# EAGLE board PT_2015_PB_MAIN_Rev2_Panelization (EAGLE 6.5.0)
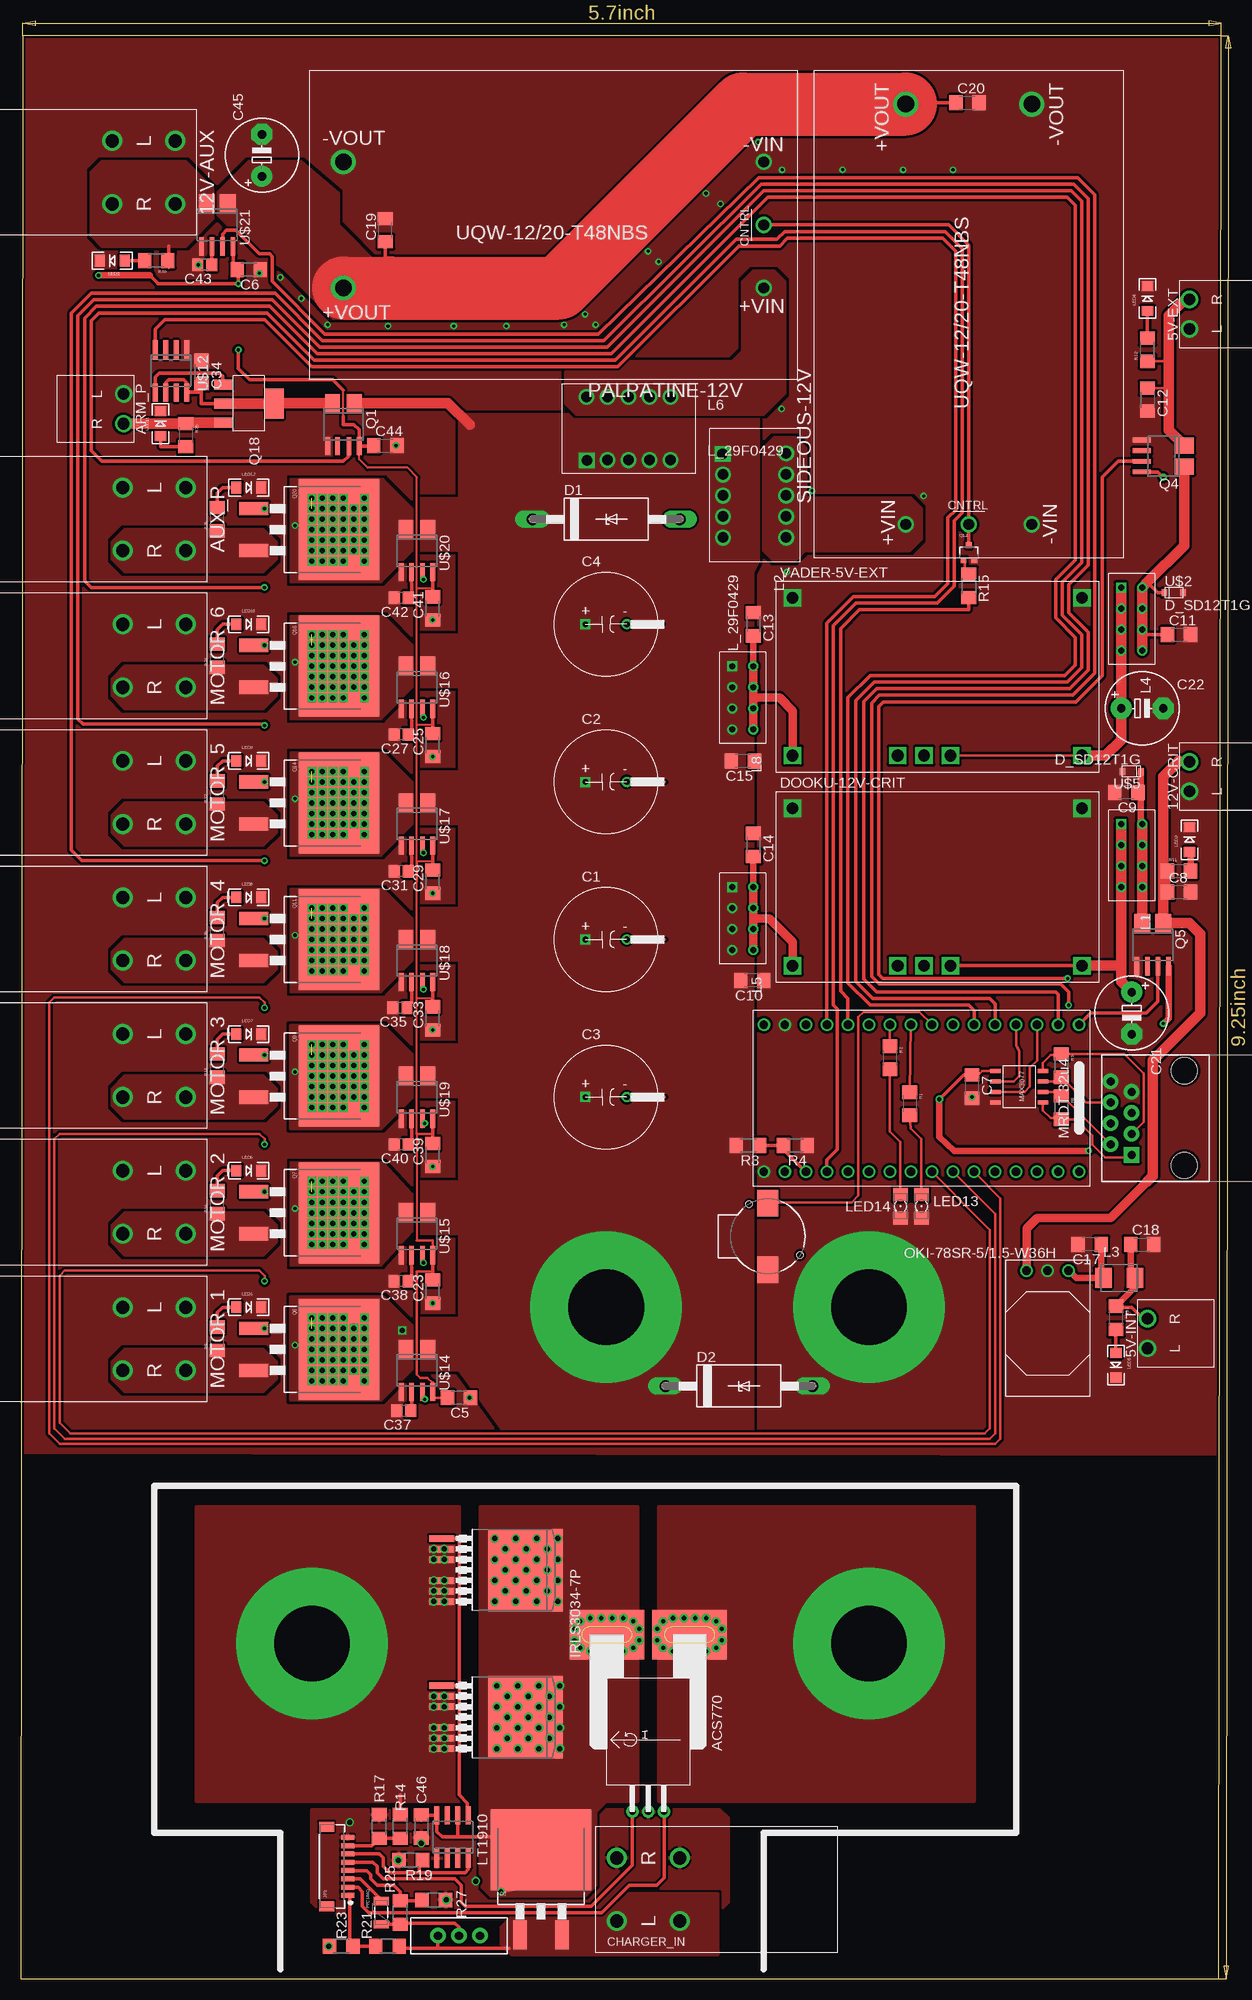
[diagram p4: board, top side]
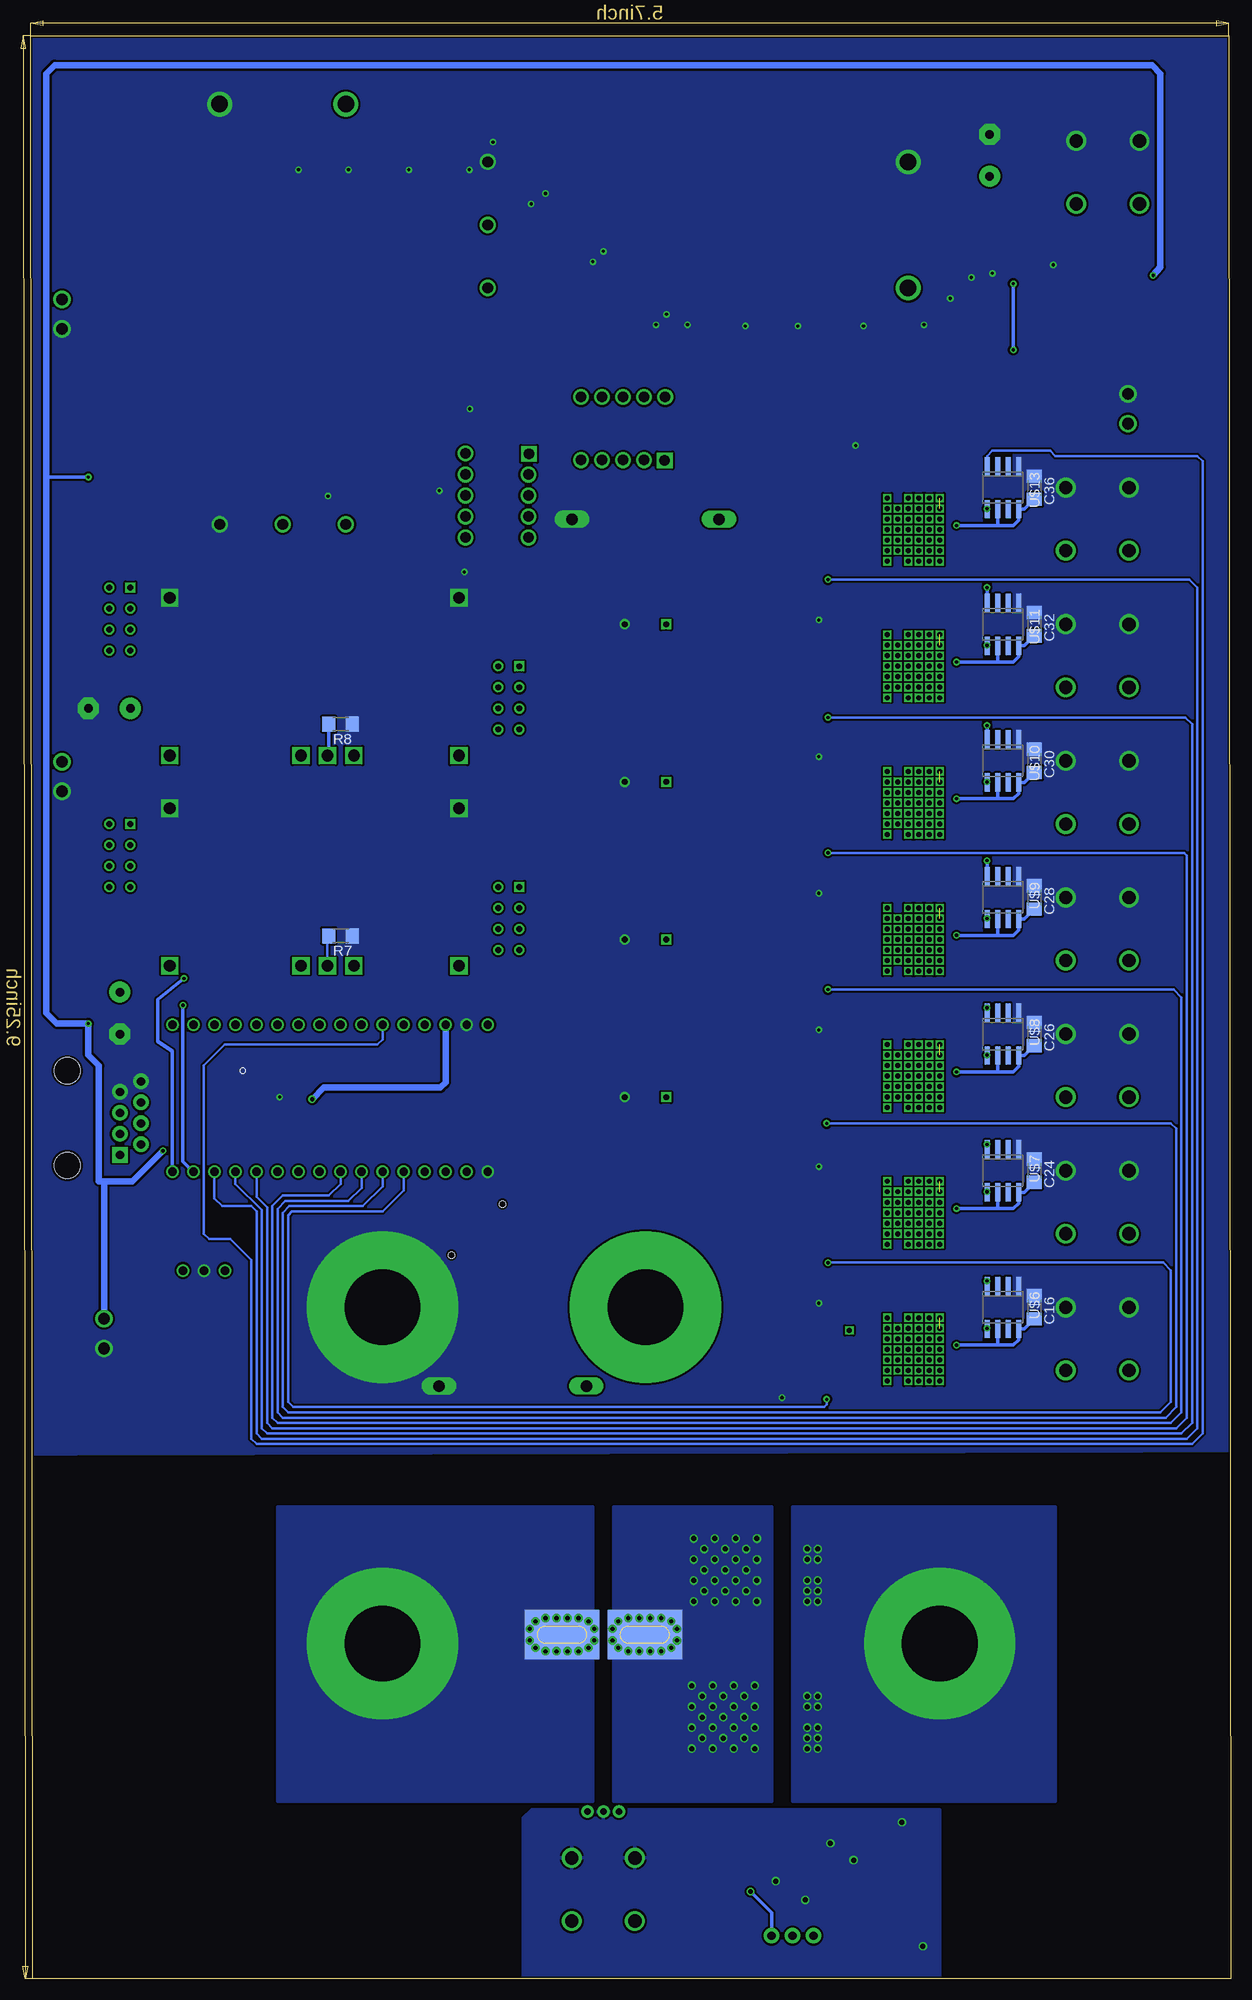
[diagram p5: board, bottom side, seen from below]

Size 145.03 x 234.82 mm. Coordinates in mm from the lower left corner, seen from the top.
Outline: 0,0 144.78,0 145.03,234.82 0.25,234.82 0,0
Copper layers (1*16): Top 0.035559375mm / dielectric 1.501140625mm / Bottom 0.035559375mm
Design rules "typical_4pcb *": minimum track width 5mil, minimum drill 15mil, track to track 10mil, track to pad 10mil, pad to pad 10mil, via to via 10mil, smd to smd 0mil, copper to edge 10mil, drill to drill 10mil, minimum pad ring 10mil, minimum via ring 8mil, stop-mask expansion 4mil, vias tented up to drill 15mil, thermal gap 10mil

## Footprints (pad centres in the part's own frame; a part is rotated, then mirrored left to right if it is on the bottom)
691322110002 = drill 1.4: L -1.79,0; R 1.79,0
20020618-M02 = drill 1.6: L1 -3.81,3.81; L2 -3.81,-3.81; R1 3.81,3.81; R2 3.81,-3.81
LARGE_TERMINAL_HOLE = drill 9.144 pad 18.288: P$1 0,0
C_12.5MM = drill 0.7 square: + -2.5,0 | drill 0.7: - 2.5,0
C1206 = smd 1.6 x 1.8: 1 -1.4,0; 2 1.4,0
E5-8,5 = drill 1.016 pad 2.54: + -2.54,0 | drill 1.016 pad 2.54 octagon: - 2.54,0
C0805 = smd 1.3 x 1.5: 1 -0.85,0; 2 0.85,0
CB429-17 = drill 1.397 long: A 8.89,0; C -8.89,0
D2PACK = smd 1.6 x 3.5: 1 -2.54,-8.275; 2 2.54,-8.275 | smd 12.2 x 9.75: TAB 0,2
R_PDSS-T7 = drill 1.4 square: 1 -17.47,9.53; 2 -17.47,-9.52; 3 -4.77,-9.52; 4 -1.59,-9.52; 5 1.59,-9.52; 6 17.47,-9.52; 7 17.47,9.53
PTC-1206 = smd 1 x 1.8: 1 -1.4,0; 2 1.4,0
D2PAK-7 = smd 0.8 x 3: 1 -3.81,-9.207; 2 -2.54,-9.207; 3 -1.27,-9.207; 4 1.27,-9.207; 5 2.54,-9.207; 6 3.81,-9.207 | smd 10 x 9: PAD 0,0.895
BM08B-SRSS-TB = smd 0.6 x 1.55: 1 -3.5,0; 2 -2.5,0; 3 -1.5,0; 4 -0.5,0; 5 0.5,0; 6 1.5,0; 7 2.5,0; 8 3.5,0 | smd 1.2 x 1.8: P$9 4.8,2.525; P$10 -4.8,2.525
L_29F0429 = drill 0.7 square: 1 -3.81,-1.27 | drill 0.7: 2 -1.27,-1.27; 3 1.27,-1.27; 4 3.81,-1.27; 5 3.81,1.27; 6 1.27,1.27; 7 -1.27,1.27; 8 -3.81,1.27
L_29F0528 = drill 1.27 pad 1.27 square: 1 -5.029,-7.671 | drill 1.27 pad 1.27: 2 -2.54,-7.62; 3 0,-7.62; 4 2.54,-7.62; 5 5.08,-7.62; 6 5.08,0; 7 2.54,0; 8 0,0; 9 -2.54,0; 10 -5.08,0
L4532M = smd 2 x 2.4: 1 -1.9,0; 2 1.9,0
LED-1206 = smd 1.2 x 1.4: A -1.5,0; C 1.5,0
FKIT-LED-1206 = smd 1.6 x 1.803: A -1.422,0; C 1.422,0
OKI-78SRH = drill 1.016: 1 2.54,0; 2 0,0; 3 -2.54,0
U-T48-QB-NO_TRIM = drill 1.3: 1 -25.4,7.62; 2 -25.4,0; 3 -25.4,-7.62 | drill 2: 4 25.4,-7.62; 8 25.4,7.62
SOIC8_ACS711_SKETCH = smd 1.8 x 2.2: 1 -1.321,-2.6; 4 1.321,-2.6 | smd 0.6 x 2.2: 5 1.905,2.6; 8 -1.905,2.6 | smd 0.55 x 2.2: 6 0.686,2.6; 7 -0.686,2.6
SOIC8_ACS711 = smd 1.92 x 2.2: 1 -1.27,-2.6; 4 1.27,-2.6 | smd 0.6 x 2.2: 5 1.905,2.6; 6 0.635,2.6; 7 -0.635,2.6; 8 -1.905,2.6
SOT323 = smd 0.7 x 0.7: 1 -0.65,-0.925; 2 0.65,-0.925; 3 0,0.925
SOT-223 = smd 1.2 x 2.2: 1 -2.3,-3.1; 2 0,-3.1; 3 2.3,-3.1 | smd 3.6 x 2.2: 4 0,3.1
1206 = smd 1.6 x 1.8: 1 -1.4,0; 2 1.4,0
R1206 = smd 1.6 x 1.803: 1 -1.422,0; 2 1.422,0
SWITCH-SPDT = drill 1.016 pad 1.88: 1 0,2.54; 2 0,0; 3 0,-2.54
BUZZER-CCV = smd 3.2 x 2.5: + 4,0; - -4,0 | hole 0.8: -3.9,-2.25; 2.25,3.9
32U4_MCU_DIP = drill 1: 1 -8.89,19.05; 2 -8.89,16.51; 3 -8.89,13.97; 4 -8.89,11.43; 5 -8.89,8.89; 6 -8.89,6.35; 7 -8.89,3.81; 8 -8.89,1.27; 9 -8.89,-1.27; 10 -8.89,-3.81; 11 -8.89,-6.35; 12 -8.89,-8.89; 13 -8.89,-11.43; 14 -8.89,-13.97; 15 -8.89,-16.51; 16 -8.89,-19.05; 17 8.89,-19.05; 18 8.89,-16.51; 19 8.89,-13.97; 20 8.89,-11.43; 21 8.89,-8.89; 22 8.89,-6.35; 23 8.89,-3.81; 24 8.89,-1.27; 25 8.89,1.27; 26 8.89,3.81; 27 8.89,6.35; 28 8.89,8.89; 29 8.89,11.43; 30 8.89,13.97; 31 8.89,16.51; 32 8.89,19.05
SOD-323 = smd 0.63 x 0.83: 1 -1.115,0; 2 1.115,0
MAX3070E = smd 0.49 x 1.3: A -1.905,2.857; B -0.635,2.857; DI 0.635,-2.857; GND 1.905,-2.857; RO -0.635,-2.857; VCC -1.905,-2.857; Y 1.905,2.857; Z 0.635,2.857
RJ45-8 = drill 1 pad 1.88 square: 1 -4.445,6.35 | drill 1 pad 1.88: 2 -3.175,8.89; 3 -1.905,6.35; 4 -0.635,8.89; 5 0.635,6.35; 6 1.905,8.89; 7 3.175,6.35; 8 4.445,8.89 | hole 3.2: -5.715,0; 5.715,0
SO8 = smd 0.6 x 2.2: 1 -1.905,-2.6; 2 -0.635,-2.6; 3 0.635,-2.6; 4 1.905,-2.6; 5 1.905,2.6; 6 0.635,2.6; 7 -0.635,2.6; 8 -1.905,2.6
PFF_LEADFORM = drill 0.8 pad 1.5: 1 -1.91,0; 2 0,0; 3 1.91,0 | drill 0.5: 4_1 3,23.4; 4_2 4.33,23.4; 4_3 5.67,23.4; 4_4 7,23.4; 4_5 8.2,23; 4_6 8.9,22.1; 4_7 8.9,20.7; 4_8 8.2,19.8; 4_9 7,19.4; 4_10 5.67,19.4; 4_11 4.33,19.4; 4_12 3,19.4; 4_13 1.8,19.8; 4_14 1.1,20.7; 4_15 1.1,22.1; 4_16 1.8,23; 5_1 -7,23.4; 5_2 -5.67,23.4; 5_3 -4.33,23.4; 5_4 -3,23.4; 5_5 -1.8,23; 5_6 -1.1,22.1; 5_7 -1.1,20.7; 5_8 -1.8,19.8; 5_9 -3,19.4; 5_10 -4.33,19.4; 5_11 -5.67,19.4; 5_12 -7,19.4; 5_13 -8.2,19.8; 5_14 -8.9,20.7; 5_15 -8.9,22.1; 5_16 -8.2,23 | smd 9 x 6 bottom: 4_B 5,21.4; 5_B -5,21.4 | smd 9 x 6: 4_T 5,21.4; 5_T -5,21.4

## Placement (x,y rotation side)
5V-EXT  H_WR-TBL_321*0002HORIZ  [691322110002]  141.22,201.17 90 top
5V-INT  H_WR-TBL_321*0002HORIZ  [691322110002]  136.14,77.98 90 top
12V-AUX  H_20020618-M02  [20020618-M02]  14.86,218.31 270 top
12V-CRIT  H_WR-TBL_321*0002HORIZ  [691322110002]  141.22,145.29 90 top
ARM_P  H_WR-TBL_321*0002HORIZ  [691322110002]  12.45,189.74 270 top
AUX_P  H_20020618-M02  [20020618-M02]  16.13,176.4 270 top
BATT-NEG  TERMINAL_HOLE  [LARGE_TERMINAL_HOLE]  102.49,81.15 0 top
BATT-POS  TERMINAL_HOLE  [LARGE_TERMINAL_HOLE]  70.74,81.15 0 top
C1  1mF  [C_12.5MM]  70.74,125.6 0 top
C2  1mF  [C_12.5MM]  70.74,144.65 0 top
C3  1mF  [C_12.5MM]  70.74,106.55 0 top
C4  1mF  [C_12.5MM]  70.74,163.7 0 top
C5  .1µF  [C1206]  52.96,70.23 180 top
C6  .1µF  [C1206]  27.56,206.57 180 top
C7  1uF  [C1206]  114.94,107.82 270 top
C8  10µf  [C1206]  139.95,131.32 0 top
C9  [C1206]  133.6,143.38 180 top
C10  2.2µF  [C1206]  88.39,120.65 180 top
C11  [C1206]  139.95,162.43 0 top
C12  47µf  [C1206]  136.14,190.85 270 top
C13  2.2µF  [C1206]  88.52,163.7 270 top
C14  2.2µF  [C1206]  88.52,137.03 270 top
C15  2.2µF  [C1206]  87.25,147.19 180 top
C16  10µF  [C1206]  23.75,81.15 270 bottom
C17  47µF  [C1206]  129.16,88.77 180 top
C18  47µF  [C1206]  135.51,88.77 0 top
C19  [C1206]  44.07,211.33 90 top
C20  [C1206]  114.4,226.73 0 top
C21  330µF  [E5-8,5]  134.24,116.71 270 top
C22  330µF  [E5-8,5]  135.51,153.54 0 top
C23  .1µF  [C1206]  49.78,83.06 90 top
C24  10µF  [C1206]  23.75,97.66 270 bottom
C25  .1µF  [C1206]  49.78,149.1 90 top
C26  10µF  [C1206]  23.75,114.17 270 bottom
C27  1nF  [C0805]  45.97,150.37 180 top
C28  10µF  [C1206]  23.75,130.68 270 bottom
C29  .1µF  [C1206]  49.78,132.59 90 top
C30  10µF  [C1206]  23.75,147.19 270 bottom
C31  1nF  [C0805]  45.97,133.86 180 top
C32  10µF  [C1206]  23.75,163.7 270 bottom
C33  .1µF  [C1206]  49.78,116.08 90 top
C34  10µF  [C1206]  21.84,194.18 270 top
C35  1nF  [C0805]  45.82,117.35 180 top
C36  10µF  [C1206]  23.75,180.21 270 bottom
C37  1nF  [C0805]  46.29,68.64 180 top
C38  1nF  [C0805]  45.94,84.33 180 top
C39  .1µF  [C1206]  49.78,99.57 90 top
C40  1nF  [C0805]  45.97,100.84 180 top
C41  .1µF  [C1206]  49.78,165.61 90 top
C42  1nF  [C0805]  45.97,166.88 180 top
C43  1nF  [C0805]  22.23,207.14 180 top
C44  .1µF  [C1206]  44.07,185.29 0 top
C45  330µF  [E5-8,5]  29.15,220.38 90 top
C46  10µF  [C1206]  48.39,18.42 270 top
CHARGER_IN  H_20020618-M02  [20020618-M02]  75.82,10.8 90 top
D1  1.5KE36A  [CB429-17]  70.74,176.4 0 top
D2  1.5KE36A  [CB429-17]  86.77,71.63 0 top
D3  D_STPS5045S  [D2PACK]  62.86,13.59 0 top
DOOKU-12V-CRIT  Q_PTN78020WAH  [R_PDSS-T7]  110.74,131.95 0 top
F1  PTCSMD  [PTC-1206]  43.56,8 90 top
IRLS3034-7P  [D2PAK-7]  60.07,49.4 270 top
IRLS3034-7P.2  [D2PAK-7]  60.07,31.62 270 top
JP1  [BM08B-SRSS-TB]  39.5,13.59 90 top
L1  L_29F0429  [L_29F0429]  134.24,135.76 270 top
L2  L_29F0429  [L_29F0528]  92.49,179.26 270 top
L3  [L4532M]  132.72,84.71 0 top
L4  L_29F0429  [L_29F0429]  134.24,164.34 270 top
L5  L_29F0429  [L_29F0429]  87.25,128.14 270 top
L6  L_29F0429  [L_29F0528]  73.44,191.17 0 top
L8  L_29F0429  [L_29F0429]  87.25,154.81 270 top
LED1  [LED-1206]  27.56,81.15 0 top
LED2  [LED-1206]  11.05,207.65 180 top
LED3  [LED-1206]  141.22,137.67 90 top
LED4  [LED-1206]  136.14,203.07 90 top
LED5  [LED-1206]  132.33,74.17 270 top
LED6  [LED-1206]  27.56,97.66 0 top
LED7  [LED-1206]  27.56,114.17 0 top
LED8  [LED-1206]  27.56,130.68 0 top
LED9  [LED-1206]  27.56,147.19 0 top
LED10  [LED-1206]  27.56,163.7 0 top
LED11  [LED-1206]  16.89,187.96 90 top
LED12  [LED-1206]  27.56,180.21 0 top
LED13  [FKIT-LED-1206]  108.84,93.38 270 top
LED14  [FKIT-LED-1206]  106.3,93.38 270 top
MOTOR_1  H_20020618-M02  [20020618-M02]  16.13,77.34 270 top
MOTOR_2  H_20020618-M02  [20020618-M02]  16.13,93.85 270 top
MOTOR_3  H_20020618-M02  [20020618-M02]  16.13,110.36 270 top
MOTOR_4  H_20020618-M02  [20020618-M02]  16.13,126.87 270 top
MOTOR_5  H_20020618-M02  [20020618-M02]  16.13,143.38 270 top
MOTOR_6  H_20020618-M02  [20020618-M02]  16.13,159.89 270 top
OKI-78SR-5/1.5-W36H  Q_OKI-78SR  [OKI-78SRH]  124.08,85.6 180 top
PALPATINE-12V  UQW-12/20-T48NBS  [U-T48-QB-NO_TRIM]  64.39,211.96 180 top
Q1  Q_ACS711LC_SKETCH  [SOIC8_ACS711_SKETCH]  38.99,187.83 180 top
Q4  Q_ACS711LC  [SOIC8_ACS711]  138.05,184.02 90 top
Q5  Q_ACS711LC  [SOIC8_ACS711]  136.78,124.97 180 top
Q6  Q_IRFS7437PbF  [D2PACK]  36.45,76.07 270 top
Q7  Q_IRFS7437PbF  [D2PACK]  36.45,92.58 270 top
Q9  Q_IRFS7437PbF  [D2PACK]  36.45,109.09 270 top
Q11  Q_IRFS7437PbF  [D2PACK]  36.45,125.6 270 top
Q12  2N7002  [SOT323]  114.55,172.34 0 top
Q14  Q_IRFS7437PbF  [D2PACK]  36.45,142.11 270 top
Q16  Q_IRFS7437PbF  [D2PACK]  36.45,158.62 270 top
Q18  Q_FDT86102LZ  [SOT-223]  27.56,190.37 270 top
Q20  Q_IRFS7437PbF  [D2PACK]  36.45,175.13 270 top
R1  1k Ohm  [1206]  107.41,105.76 270 top
R2  1k Ohm  [1206]  105.03,111.32 270 top
R3  60kΩ  [R1206]  87.88,100.71 180 top
R4  10kΩ  [R1206]  93.6,100.71 180 top
R5  120 Ohm  [1206]  125.73,110.36 270 top
R6  120 Ohm  [1206]  125.73,105.28 270 top
R7  590Ω  [R1206]  107.57,126.05 180 bottom
R8  21kΩ  [R1206]  107.57,151.64 180 bottom
R9  1kΩ  [1206]  23.75,77.34 90 top
R10  1kΩ  [1206]  16.38,207.65 180 top
R11  1kΩ  [1206]  139.95,133.86 0 top
R12  1kΩ  [1206]  136.14,196.88 90 top
R13  1kΩ  [1206]  132.33,79.88 270 top
R14  60kΩ  [R1206]  45.85,18.42 270 top
R15  [R1206]  114.55,168.34 270 top
R16  1kΩ  [1206]  23.75,93.85 90 top
R17  10kΩ  [R1206]  43.31,18.42 90 top
R18  1kΩ  [1206]  23.75,110.36 90 top
R19  10k  [R1206]  47.12,14.35 180 top
R20  1kΩ  [1206]  23.75,126.87 90 top
R21  60kΩ  [R1206]  44.32,3.94 180 top
R22  1kΩ  [1206]  23.75,143.38 90 top
R23  10kΩ  [R1206]  38.73,3.94 180 top
R24  1kΩ  [1206]  23.75,159.89 90 top
R25  60kΩ  [R1206]  45.85,8 270 top
R26  1kΩ  [1206]  19.94,186.56 270 top
R27  10kΩ  [R1206]  49.91,9.53 180 top
R28  1kΩ  [1206]  23.75,176.4 90 top
S1  [SWITCH-SPDT]  52.96,5.21 270 top
SG1  BUZZERSMD2  [BUZZER-CCV]  90.27,89.73 270 top
SIDEOUS-12V  UQW-12/20-T48NBS  [U-T48-QB-NO_TRIM]  114.55,201.17 90 top
U$1  32U4_BREAKOUT  [32U4_MCU_DIP]  108.84,106.43 270 top
U$2  D_SD12T1G  [SOD-323]  139.32,167.51 0 top
U$3  MAX3077  [MAX3070E]  120.65,107.82 270 top
U$4  RJ45-8PTH  [RJ45-8]  140.59,104.01 90 top
U$5  D_SD12T1G  [SOD-323]  134.24,145.92 180 top
U$6  LT1910  [SO8]  27.56,81.15 180 bottom
U$7  LT1910  [SO8]  27.56,97.66 180 bottom
U$8  LT1910  [SO8]  27.56,114.17 180 bottom
U$9  LT1910  [SO8]  27.56,130.68 180 bottom
U$10  LT1910  [SO8]  27.56,147.19 180 bottom
U$11  LT1910  [SO8]  27.56,163.7 180 bottom
U$12  LT1910  [SO8]  18.16,194.31 180 top
U$13  LT1910  [SO8]  27.56,180.21 180 bottom
U$14  ACS714LLCTR-50A-T  [SOIC8_ACS711_SKETCH]  47.88,73.53 180 top
U$15  ACS714LLCTR-50A-T  [SOIC8_ACS711_SKETCH]  47.88,90.04 180 top
U$16  ACS714LLCTR-50A-T  [SOIC8_ACS711_SKETCH]  47.88,156.08 180 top
U$17  ACS714LLCTR-50A-T  [SOIC8_ACS711_SKETCH]  47.88,139.57 180 top
U$18  ACS714LLCTR-50A-T  [SOIC8_ACS711_SKETCH]  47.88,123.06 180 top
U$19  ACS714LLCTR-50A-T  [SOIC8_ACS711_SKETCH]  47.88,106.55 180 top
U$20  ACS714LLCTR-50A-T  [SOIC8_ACS711_SKETCH]  47.88,172.59 180 top
U$21  ACS714LLCTR-50A-T  [SOIC8_ACS711]  23.75,211.96 180 top
U$22  ACS770  [PFF_LEADFORM]  75.82,20.19 0 top
U$23  LT1910  [SO8]  52.2,17.15 0 top
V_ARRAY  TERMINAL_HOLE  [LARGE_TERMINAL_HOLE]  102.49,40.51 180 top
V_OUT  TERMINAL_HOLE  [LARGE_TERMINAL_HOLE]  35.18,40.51 180 top
VADER-5V-EXT  Q_PTN78020WAH  [R_PDSS-T7]  110.74,157.35 0 top

## Tracks (layer width: path | path; a pad name or v marks a point on that pad's centre or on a via)
0  (via drill 0.38)
  Top 0.406: v54.23,70.23 C5.1
  other vias: 49.78,81.66 49.78,98.17 49.78,114.68 49.78,131.19 49.78,147.7 49.78,164.21 45.34,185.29 114.94,106.55 28.83,206.12 21.46,207.14 109.09,179.2 92.61,170.02 95.63,179.83 91.95,189.74 31.37,205.61 33.91,203.07 37.08,199.9 44.39,199.74 52.32,199.74 58.67,199.74 65.66,199.9 68.2,201.17 69.47,199.9 75.82,208.79 77.09,207.52 84.55,214.5 82.8,215.77 92.01,218.63 89.15,221.96 99.31,218.63 106.62,218.63 112.65,218.63
  pour Bottom (no thermals): -10.79,63.88 160.91,63.37 160.91,239.9 -10.79,240.41
  pour Top (isolate 0.305, rank 4, no thermals): -13.59,242.06 152.65,241.81 152.65,63.37 -13.59,63.63
5V-EXT
  Top 0.305: C12.1 138.66,192.25 138.68,192.28 | R12.1 138.18,195.48 138.68,194.98
  Top 1.27: 140.7,202.96 5V-EXT.R 140.63,202.96 138.68,201.01 138.68,194.98 138.68,192.28 138.68,187.14 Q4.4
5V-IMEAS  (via drill 0.38)
  Top 0.406: v126.49,120.9 104.14,120.9 103.66,121.38 103.66,153.76 104.2,154.31 127.48,154.31 130.68,157.51 130.68,181.48 132.59,183.39 Q4.7
  Bottom 0.406: U$1.32 127.89,112.14 129.67,113.28 129.67,118.36 v126.49,120.9
5V_SSR
  Top 0.406: JP1.5 42.55,14.09 43.05,13.59 43.05,12.83 43.81,12.07 52.45,12.07 53.21,11.3 53.21,9.27 53.72,8.76 68.96,8.76 73.91,13.71 U$22.1
12V-AUX
  Top 0.406: R10.1 17.91,206.88 17.91,209.42
  pour Top (rank 2, no thermals): 23.75,215.77 23.75,213.23 19.94,209.42 9.78,209.42 8.51,210.69 8.51,218.31 9.78,219.58 19.94,219.58
12V-CRIT
  Top 0.406: C8.1 138.05,137.67
  Top 0.813: R11.1 138.55,131.82 138.05,131.32
  Top 1.016: OKI-78SR-5/1.5-W36H.1 121.54,90.68 122.81,91.95 131.7,91.95 136.14,96.39
  Top 1.27: 12V-CRIT.R 139.84,147.19 139.95,147.19 138.05,145.29 138.05,137.67 138.05,131.32 Q5.1 141.16,127.57 142.49,126.24 142.49,116.71 136.78,111 136.78,97.03 136.14,96.39
12V-IMEAS  (via drill 0.38)
  Top 0.406: v126.62,117.67 126.62,119.25 125.67,120.21 103.76,120.21 102.81,121.16 102.81,154.18 103.76,155.13 127.09,155.13 129.79,157.83 129.79,215.61 127.73,217.68 89.15,217.68 69.79,198.79 36.77,198.79 30.42,205.14 30.42,208.15 30.1,208.47 28.83,208.47 25.97,211.33 24.86,211.33 24.38,210.85 U$21.7
  Bottom 0.406: U$1.31 126.62,98.81 v126.62,117.67
12V-SIG
  Top 0.406: R15.2 114.53,167.21 114.53,165.48 101.35,165.48 99.06,163.19 99.06,119.38 99.95,118.49 U$1.12
+5V  (via drill 0.38, 0.5)
  Top 0.254: 47.88,118.49 47.88,102.11 47.88,89.25 | 47.88,118.49 47.88,132.59 | 47.88,151.51 47.88,135 49.78,135 | 47.88,151.51 47.88,168.02 | 47.88,168.02 47.88,181.48 46.74,182.63 41.91,182.63 40.89,183.64 40.89,184.53 | 49.78,118.49 47.88,118.49 | 49.78,151.51 47.88,151.51 | 49.78,168.02 47.88,168.02 | 38.99,188.85 38.99,192.02
  Top 0.279: C7.1 115.7,109.22 116.2,109.73 U$3.VCC | 47.88,132.59 47.88,135
  Top 0.305: 49.78,70.23 C5.2 | U$19.8 49.78,102.11 47.88,102.11 | C33.2 49.78,118.49 | C29.2 49.78,135 | C25.2 49.78,151.51 | U$20.8 49.78,168.02 | C23.2 49.78,85.47 47.88,85.47 47.88,73.03 48.26,72.64 49.15,72.64 49.78,72.01 | 40.89,184.53 Q1.8 40.89,186.06 | 26.29,206.12 C6.2 | 47.88,89.25 49.78,89.25 U$15.8
  Top 0.406: C23.2 U$15.8 | U$19.8 C39.2 | U$18.8 C33.2 | U$17.8 C29.2 | U$16.8 C25.2 | U$20.8 C41.2 | U$21.8 25.65,206.75 C6.2 | Q1.8 42.61,185.23 C44.1 | 133.83,88.5 C18.1 | 5V-INT.R 135.62,79.77 134.24,81.15 132.46,81.15 R13.1 | C7.1 113.92,109.22 v111,106.3 | Q4.8 137.41,182.12 v138.05,181.48 | 38.99,192.02 37.72,193.29 27.69,193.29 26.29,194.56 v26.29,196.85 | 26.29,206.12 v26.29,204.85 16.64,204.85 | 16.57,204.85 16.64,204.85 | 40.89,186.06 40.89,187.2 40.26,187.83 38.99,187.83 38.99,188.85 | 49.78,72.01 U$14.8 49.78,70.23 49.78,70.1 | 15.62,205.87 16.64,204.85
  Top 0.813: v129.03,100.08 112.81,100.08 111,101.76 v111,106.3 | v138.05,115.44 138.68,116.08 Q5.8 | v9.4,205.87 15.62,205.87 | C18.1 134.11,85.22 L3.2 134.62,83.56 R13.1
  Bottom 0.406: 136.14,79.88 5V-INT.R | v26.29,196.85 v26.29,204.85 | v138.05,181.48 143.13,181.48
  Bottom 0.813: 136.14,79.88 136.14,96.39 | v111,106.3 109.6,107.7 95.5,107.7 94.87,108.33 U$1.14 | v129.03,100.08 132.72,96.39 136.14,96.39 | 136.14,96.39 136.78,96.39 136.78,110.36 138.05,111.63 v138.05,115.44 141.86,115.44 143.13,116.71 143.13,181.48 143.13,230.25 142.11,231.27 9.53,231.27 8.51,230.25 8.51,206.88 v9.4,205.87
ARM_P-IMEAS
  Top 0.406: Q1.7 39.62,184.02 38.99,183.39 9.78,183.39 8.51,184.66 8.51,200.37 9.46,201.33 29.78,201.33 35.5,195.61 71.85,195.61 86.45,210.22 91.38,210.22 92.33,211.17 111.7,211.17 113.76,209.11 113.76,177.2 112.81,176.24 112.81,168.31 110.74,166.24 100.9,166.24 98.2,163.54 98.2,117.67 98.68,117.19 98.68,100.2 97.41,98.93 U$1.20
ARM_P-SIG
  Top 0.406: U$12.4 16.26,199.39 17.4,200.53 29.46,200.53 35.18,194.82 72.17,194.82 86.77,209.42 91.69,209.42 92.65,210.38 111.38,210.38 112.97,208.79 112.97,177.51 112.01,176.56 112.01,168.62 110.43,167.04 100.58,167.04 97.41,163.86 U$1.13
AUX_P-IMEAS  (via drill 0.38)
  Top 0.305: U$20.7 48.67,169.83 v48.67,169.1
  Bottom 0.305: v48.67,169.1 5.02,169.1 4.06,168.15 4.06,66.55 5.33,65.28 117.09,65.28 117.73,65.91 117.73,92.74 118.36,93.38 121.86,93.38 122.81,94.33 U$1.30
AUX_P-SIG
  Bottom 0.305: U$13.4 29.46,184.02 28.83,184.66 21.84,184.66 21.21,184.02 4.06,184.02 3.43,183.39 3.43,65.91 4.7,64.64 117.73,64.64 118.36,65.28 118.36,86.87 120.9,89.41 123.44,89.41 124.08,90.04 124.08,110.36 121.54,112.9 103.12,112.9 102.49,113.54 U$1.11
BUZZ_BUZZ_MOTHERFUCKER
  Top 0.305: SG1.- 90.39,93.85 100.43,93.85 101.22,94.65 101.22,99.57 101.22,102.58 101.22,116.24 101.85,116.87 108.55,116.87 U$1.8
CRIT-IMEAS
  Top 0.406: U$1.1 129.32,116.71 136.02,116.71 137.41,118.11 Q5.7
GATE
  Top 0.406: U$23.4 54.1,13.21 53.72,12.83 48.13,12.83 | 48.13,12.83 48.13,14.2 R19.1 | 48.13,12.83 44.58,12.83 43.81,13.59 43.81,14.61 43.33,15.09 JP1.6
GND_SSR  (via drill 0.6)
  Top 0.406: R23.2 v37.21,3.94
  other vias: 54.99,11.81 48.39,16.38 45.59,14.35 51.43,9.53 39.75,18.92
  pour Top (rank 3): 84.45,20.45 35.18,20.45 35.18,9.27 36.45,8 84.2,8 85.47,9.27 85.47,19.43
  pour Bottom (rank 2): 84.45,20.45 35.18,20.45 35.18,-2.92 85.47,-2.92 85.47,19.43
I_ARRAY
  Top 0.406: U$22.3 77.73,12.2 76.84,11.3 73.53,11.3 70.23,8 42.04,8 41.27,8.76 41.27,10.54 40.77,11.05 39.54,11.05 JP1.2
INFO_LED_1
  Top 0.305: U$1.9 R1.1
INFO_LED_2
  Top 0.305: U$1.10 R2.1
LOGIC_POWER
  Top 0.406: 43.56,9.53 F1.2 43.31,9.66 43.31,9.78 41.02,12.07 39.52,12.07 JP1.3
M1-IMEAS  (via drill 0.38)
  Top 0.305: 48.51,70.36 v48.83,70.04
  Top 0.406: U$14.7 48.51,70.36
  Bottom 0.305: v48.83,70.04 48.83,69.41 49.15,69.09 113.28,69.09 113.92,69.72 113.92,92.27 113.44,92.74 102.49,92.74 99.95,95.28 U$1.21
M1-SIG  (via drill 0.38)
  Top 0.305: v29.46,84.33 29.46,84.96 28.83,85.6 5.33,85.6 4.7,84.96 4.7,67.18 5.97,65.91 116.46,65.91 117.09,66.55 117.09,90.52 114.08,93.53 111.7,95.95 U$1.25
  Bottom 0.305: U$6.4 v29.46,84.33
M2-IMEAS  (via drill 0.38)
  Top 0.406: U$15.7 48.51,86.71 v48.67,86.55
  Bottom 0.305: v48.67,86.55 8.19,86.55 7.24,85.6 7.24,69.72 8.51,68.45 113.92,68.45 114.55,69.09 114.55,92.58 113.76,93.38 104.87,93.38 102.49,95.76 U$1.22
M2-SIG  (via drill 0.38)
  Top 0.305: v29.46,100.84 29.46,101.47 28.83,102.11 4.7,102.11 4.06,101.47 4.06,66.55 5.33,65.28 117.09,65.28 117.73,65.91 117.73,92.42 112.65,97.5 U$1.26
  Bottom 0.305: U$7.4 v29.46,100.84
M3-IMEAS  (via drill 0.38)
  Top 0.305: v48.83,103.38 48.83,103.64 U$19.7
  Bottom 0.305: v48.83,103.38 7.24,103.38 6.6,102.74 6.6,69.09 7.87,67.82 114.55,67.82 115.19,68.45 115.19,93.06 114.24,94.01 106.62,94.01 105.03,95.6 U$1.23
M3-SIG  (via drill 0.38)
  Top 0.305: v29.46,117.35 29.46,117.98 28.83,118.62 4.06,118.62 3.43,117.98 3.43,65.91 4.7,64.64 117.73,64.64 118.36,65.28 118.36,94.33 115.19,97.5 U$1.27
  Bottom 0.305: U$8.4 v29.46,117.35
M4-IMEAS  (via drill 0.38)
  Top 0.305: U$18.7 48.67,120.3 v48.67,119.57
  Bottom 0.305: v48.67,119.57 6.92,119.57 5.97,118.62 5.97,68.45 7.24,67.18 115.19,67.18 115.82,67.82 115.82,93.38 114.55,94.65 109,94.65 107.57,96.08 U$1.24
M4-SIG  (via drill 0.38)
  Top 0.406: v29.46,135.13 7.4,135.13 6.13,136.4 6.13,201.33 8.51,203.71 30.73,203.71 36.45,197.99 70.42,197.99 89.47,216.88 127.25,216.88 129,215.14 129,170.85 126.62,168.47 126.62,165.13 129,162.75 129,158.15 126.78,155.92 103.44,155.92 101.85,154.34 101.85,120.84 103.44,119.25 125.03,119.25 125.35,118.94 U$1.2
  Bottom 0.406: v29.46,135.13 U$9.4
M5-IMEAS  (via drill 0.38)
  Top 0.305: v48.67,136.08 48.67,136.81 U$17.7
  Bottom 0.305: v48.67,136.08 5.65,136.08 5.33,135.76 5.33,67.82 6.6,66.55 115.82,66.55 116.46,67.18 116.46,93.22 117.73,94.49 U$1.28
M5-SIG  (via drill 0.38)
  Top 0.406: v29.46,151.48 29.3,151.64 7.56,151.64 6.92,152.27 6.92,201.01 8.83,202.91 30.42,202.91 36.13,197.2 70.9,197.2 89.79,216.09 126.94,216.09 128.21,214.82 128.21,171.16 125.83,168.78 125.83,164.81 128.21,162.43 128.21,158.46 126.46,156.72 103.12,156.72 100.9,154.5 100.9,120.52 102.97,118.46 117.09,118.46 117.73,117.82 U$1.5
  Bottom 0.406: U$10.4 v29.46,151.48
M6-IMEAS  (via drill 0.38)
  Top 0.305: 48.67,152.59 U$16.7 48.67,153.32 v48.67,152.43
  Bottom 0.305: v48.67,152.43 5.49,152.43 4.7,151.64 4.7,67.18 5.97,65.91 116.46,65.91 117.09,66.55 117.09,92.9 120.27,96.08 U$1.29
M6-SIG  (via drill 0.38)
  Top 0.406: v29.46,168.15 8.51,168.15 7.71,168.94 7.71,200.69 9.14,202.12 30.1,202.12 35.81,196.41 71.37,196.41 90.27,215.3 126.46,215.3 127.41,214.34 127.41,171.48 125.03,169.1 125.03,164.5 127.41,162.12 127.41,158.78 126.14,157.51 102.65,157.51 99.95,154.81 99.95,120.36 102.65,117.67 114.55,117.67 115.19,117.03 U$1.6
  Bottom 0.406: U$11.4 v29.46,168.15
N$1
  Top 0.406: U$14.6 47.24,69.21 C37.1
N$2
  Top 0.406: U$15.6 47.24,84.83 C38.1
N$3
  Top 0.813: L8.8 C13.2
  Top 1.016: L8.8 L8.7 88.52,154.81 | L8.5 L8.6 88.52,154.81 | VADER-5V-EXT.2 93.27,153.23 91.69,154.81 88.52,154.81
N$4
  Top 0.406: Q12.3 SIDEOUS-12V.2 114.55,209.52 112.11,211.96 PALPATINE-12V.2
N$5
  pour Top (no thermals): 67.12,189.1 89.79,189.1 92.33,191.64 92.33,205.1 91.06,206.38 88.52,206.38 87.25,205.1 87.25,196.72 85.98,195.45 67.12,195.45 65.85,194.18 65.85,190.37
N$6
  pour Top (no thermals): 91.06,186.25 89.79,184.98 89.79,172.59 91.06,171.32 93.44,171.32 94.71,172.59 107.44,172.59 108.84,173.99 108.84,177.67 107.57,178.94 94.87,178.94 94.87,184.98 93.6,186.25
N$7
  Top 0.406: C20.1 106.93,226.73 SIDEOUS-12V.8 | C19.1 44.07,206.88 43.59,206.88 43.59,206.25 44.39,206.25 44.39,205.93 44.7,205.93 44.7,204.34
  Top 7.62: PALPATINE-12V.8 44.7,204.34 65.02,204.34 87.25,226.57 SIDEOUS-12V.8
  pour Top: 33.91,219.58 31.69,219.58 31.69,206.88 37.72,200.69 43.43,200.69 43.43,206.88 38.35,211.96 38.35,215.77
  pour Top (no thermals): 31.85,219.58 31.85,206.72 27.56,209.42 23.75,213.23 23.75,215.77 27.56,219.58
N$8
  Top 0.813: C14.2 L5.8
  Top 1.016: L5.8 L5.7 88.52,128.14 | 88.52,128.14 L5.6 L5.5 | DOOKU-12V-CRIT.2 93.27,125.29 90.42,128.14 88.52,128.14
N$9
  Bottom 0.305: DOOKU-12V-CRIT.4 109.15,125.88 R7.2
N$10
  Top 0.813: L1.8 135.35,139.73 U$5.1 135.35,143.73 C9.1
  Top 1.27: L1.8 L1.7 L1.6 L1.5 Q5.4
N$11
  Top 0.305: LED13.A 108.84,101.47 107.57,102.74 R1.2
N$12
  Top 0.406: U$21.6 C43.1
N$14
  Top 0.305: U$3.Y 123.51,104.97 124.46,104.01 125.6,104.01 R6.2 127.54,103.88 129.48,101.95 129.48,100.84 131.06,99.25 133.92,99.25 U$4.1
N$15
  Top 0.305: VADER-5V-EXT.6 VADER-5V-EXT.5
  Top 1.27: VADER-5V-EXT.6 131.07,147.83 132.97,149.73 C22.+ L4.4 L4.3 L4.2 L4.1
N$16
  Top 0.406: U$2.1 137.41,167.51 136.14,168.78 | C11.1 136.14,162.43 L4.6
  Top 1.27: L4.5 L4.6 L4.7 L4.8 136.14,168.78 140.59,173.23 140.59,182.69 Q4.1
N$17
  Top 0.406: U$16.6 47.24,150.87 C27.1
N$18
  Top 0.305: U$3.Z 125.23,107.19 R6.1 125.85,106.68 U$4.2
N$19
  Top 0.305: U$3.B 125.23,108.46 R5.2 128.78,105.92 U$4.6
N$20
  Top 0.305: U$3.A 123.51,110.68 124.46,111.63 125.6,111.63 R5.1 133.31,111.76 135.67,109.41 135.67,103.54 U$4.3
N$21
  Top 0.305: U$3.DI 121.29,107.19 121.92,107.82 121.92,110.11 122.81,111 U$1.3
N$22
  Top 0.406: U$17.6 47.24,134.36 C31.1
N$23
  Top 0.406: C35.1 47.24,117.98 U$18.6
N$24
  Top 0.406: U$19.6 47.24,101.34 C40.1
N$25
  Top 0.406: U$20.6 47.24,167.38 C42.1
N$28  (via drill 0.38)
  Bottom 0.406: v33.15,93.09 28.19,93.09 | 28.19,93.09 26.29,93.09 25.65,93.73 U$7.8 24.95,95.06 C24.2 | U$7.6 28.19,93.09
  pour Top (rank 2, no thermals): 32.64,98.68 43.81,98.68 47.31,94.87 47.31,90.3 43.56,86.23 32.64,86.23
N$29
  pour Top (no thermals): 11.05,89.03 11.05,91.06 12.57,92.58 29.34,92.58 30.86,91.06 30.86,89.03 29.34,87.5 12.57,87.5
N$30  (via drill 0.38)
  Top 0.406: Q7.1 v29.46,95.12
  Bottom 0.406: v29.46,95.12 U$7.5
N$31
  Top 0.406: R16.2 23.75,97.03 24.38,97.66 LED6.A
N$32
  Top 0.305: LED14.A 106.3,101.16 105.03,102.43 R2.2
N$33  (via drill 0.6)
  Top 0.406: R14.1 45.85,22.23
  other vias: 51.18,27.81 49.91,27.81 51.18,29.08 49.91,29.08 51.18,30.35 49.91,30.35 51.18,32.89 49.91,32.89 51.18,34.16 49.91,34.16 49.91,45.59 51.18,45.59 51.18,48.13 51.18,46.86 49.91,46.86 49.91,48.13 49.91,50.67 49.91,51.94 51.18,51.94 51.18,50.67
  pour Bottom (no thermals): 21.21,57.02 52.96,57.02 52.96,21.46 21.21,21.46
  pour Top (no thermals): 21.21,57.02 52.96,57.02 52.96,21.46 21.21,21.46
N$34
  Top 0.254: 76.2,163.7 77.6,163.7
N$35
  Bottom 0.406: R8.2 108.99,148 VADER-5V-EXT.4
N$36
  Top 0.406: DOOKU-12V-CRIT.5 DOOKU-12V-CRIT.6
  Top 1.27: DOOKU-12V-CRIT.6 132.97,122.43 | 132.97,122.43 132.97,123.06 L1.4 L1.3 L1.2 L1.1 | C21.+ 132.97,120.53 132.97,122.43
N$37
  Top 0.254: 76.45,144.65 77.85,144.65
N$38
  Top 0.254: 76.45,125.6 77.85,125.6
N$39
  Top 0.406: R9.2 23.75,80.52 24.38,81.15 LED1.A
N$40  (via drill 0.38, 0.6)
  Bottom 0.406: v33.15,76.58 28.32,76.58 | 28.32,76.58 26.29,76.58 25.65,77.22 U$6.8 24.95,78.55 C16.2 | U$6.6 28.19,76.71 28.32,76.58
  other vias: 46.1,78.36
  pour Top (rank 3, no thermals): 32.64,82.42 43.81,82.42 47.62,78.61 47.62,74.04 43.56,69.98 32.64,69.98
N$41
  pour Top (no thermals): 11.05,72.52 11.05,74.55 12.57,76.07 29.34,76.07 30.86,74.55 30.86,72.52 29.34,70.99 12.57,70.99
N$42  (via drill 0.38)
  Top 0.406: Q6.1 v29.46,78.61
  Bottom 0.406: U$6.5 v29.46,78.61
N$43
  Top 0.254: 77.85,106.55 76.33,106.55
N$44  (via drill 0.38)
  Bottom 0.406: v33.15,109.6 28.19,109.6 | 28.19,109.6 26.29,109.6 25.65,110.24 U$8.8 24.95,111.57 C26.2 | U$8.6 28.19,109.6
  pour Top (rank 3, no thermals): 32.64,115.19 43.81,115.19 47.62,111.38 47.62,106.81 43.56,102.74 32.64,102.74
N$45
  pour Top (no thermals): 11.05,105.54 11.05,107.57 12.57,109.09 29.34,109.09 30.86,107.57 30.86,105.54 29.34,104.01 12.57,104.01
N$46
  Top 0.406: LED2.A R10.2
N$47  (via drill 0.38)
  Top 0.406: Q9.1 v29.46,111.63
  Bottom 0.406: U$8.5 v29.46,111.63
N$48
  Top 0.813: R11.2 141.35,136.04 LED3.A
N$49
  Top 0.406: R18.2 23.75,113.54 24.38,114.17 LED7.A
N$50
  Top 0.406: LED4.A 136.07,201.57 136.14,201.33 R12.2
N$51  (via drill 0.6)  (1 unrouted)
  other vias: 35.18,178.94 35.18,177.67
N$52
  Top 0.406: R13.2 LED5.A
N$53  (via drill 0.6)
  other vias: 36.45,178.94
N$54  (via drill 0.38)
  Bottom 0.406: v33.15,126.11 28.19,126.11 | 28.19,126.11 26.29,126.11 25.65,126.75 U$9.8 24.95,128.08 C28.2 | U$9.6 28.19,126.11
  pour Top (rank 3, no thermals): 32.64,131.7 43.81,131.7 47.62,127.89 47.62,123.32 43.56,119.25 32.64,119.25
N$55
  pour Top (no thermals): 11.05,122.05 11.05,124.08 12.57,125.6 29.34,125.6 30.86,124.08 30.86,122.05 29.34,120.52 12.57,120.52
N$56  (via drill 0.38)
  Top 0.406: Q11.1 v29.46,128.14
  Bottom 0.406: U$9.5 v29.46,128.14
N$57
  Top 0.406: R20.2 23.75,130.05 24.38,130.68 LED8.A
N$58  (via drill 0.6)
  other vias: 37.72,178.94
N$59  (via drill 0.6)
  other vias: 38.99,178.94
N$60  (via drill 0.38)
  Bottom 0.406: v33.15,142.62 28.32,142.62 | 28.32,142.62 26.29,142.62 25.65,143.26 U$10.8 24.95,144.59 C30.2 | U$10.6 28.19,142.75 28.32,142.62
  pour Top (rank 3, no thermals): 32.64,148.21 43.81,148.21 47.62,144.4 47.62,139.83 43.56,135.76 32.64,135.76
N$61
  pour Top (no thermals): 11.05,138.56 11.05,140.59 12.57,142.11 29.34,142.11 30.86,140.59 30.86,138.56 29.34,137.03 12.57,137.03
N$62  (via drill 0.38)
  Top 0.406: Q14.1 v29.46,144.65
  Bottom 0.406: U$10.5 v29.46,144.65
N$63
  Top 0.406: R22.2 23.75,146.56 24.38,147.19 LED9.A
N$64  (via drill 0.6)  (1 unrouted)
  other vias: 35.18,162.43 35.18,161.16
N$65  (via drill 0.6)
  other vias: 41.53,178.94
N$66  (via drill 0.38)
  Bottom 0.406: v33.15,159.13 28.07,159.13 | 28.07,159.13 26.29,159.13 25.65,159.77 U$11.8 24.95,161.1 C32.2 | U$11.6 28.19,159.26 28.07,159.13
  pour Top (rank 3, no thermals): 32.64,164.72 43.91,164.72 47.62,160.94 47.62,156.34 43.56,152.27 32.64,152.27
N$67
  pour Top (no thermals): 11.05,155.07 11.05,157.1 12.57,158.62 29.34,158.62 30.86,157.1 30.86,155.07 29.34,153.54 12.57,153.54
N$68  (via drill 0.38)
  Top 0.406: Q16.1 v29.46,161.16
  Bottom 0.406: U$11.5 v29.46,161.16
N$69
  Top 0.406: R24.2 23.75,163.07 24.38,163.7 LED10.A
N$70  (via drill 0.6)
  other vias: 40.26,177.67
N$71  (via drill 0.6)
  other vias: 40.26,176.4
N$72
  Top 0.406: Q18.2 21.84,190.37 21.84,192.02 | 21.84,192.02 C34.2 | U$12.8 20.07,191.77 | 20.07,191.77 20.07,192.91 19.68,193.29 17.91,193.29 17.53,192.91 U$12.6 | 20.07,191.77 21.59,191.77 21.84,192.02
  Top 1.27: Q1.4 30.72,190.43 Q18.4 Q18.2
N$73
  Top 1.27: Q18.3 20.05,188.07 R26.1 12.94,187.96 ARM_P.R
N$74
  Top 0.406: U$12.5 16.26,193.55 16.76,194.06 24,194.06 24.38,193.68 24.38,192.75 Q18.1
N$75
  Top 0.406: LED11.A 16.89,185.17 R26.2
N$76  (via drill 0.6)
  other vias: 40.26,173.86
N$77  (via drill 0.6)
  other vias: 40.26,175.13
N$78  (via drill 0.38)
  Bottom 0.406: v33.15,175.64 28.32,175.64 | 28.32,175.64 26.29,175.64 25.65,176.28 U$13.8 24.95,177.61 C36.2 | U$13.6 28.19,175.77 28.32,175.64
  pour Top (rank 3, no thermals): 32.64,181.23 43.81,181.23 47.62,177.42 47.62,172.85 43.56,168.78 32.64,168.78
N$79
  pour Top (no thermals): 11.05,171.58 11.05,173.61 12.57,175.13 29.34,175.13 30.86,173.61 30.86,171.58 29.34,170.05 12.57,170.05
N$80  (via drill 0.38)
  Top 0.406: Q20.1 v29.46,177.67
  Bottom 0.406: U$13.5 v29.46,177.67
N$81
  Top 0.406: R28.2 23.75,179.58 24.38,180.21 LED12.A
N$82  (via drill 0.6)
  other vias: 40.26,172.59
N$83  (via drill 0.6)
  other vias: 38.99,177.67
N$84  (via drill 0.6)
  other vias: 38.99,176.4
N$85  (via drill 0.6)
  other vias: 38.99,175.13
N$86  (via drill 0.6)
  other vias: 38.99,173.86
N$87  (via drill 0.6)
  other vias: 38.99,172.59
N$88  (via drill 0.6)
  other vias: 38.99,171.32
N$89  (via drill 0.6)
  other vias: 36.45,172.59
N$90  (via drill 0.6)
  other vias: 37.72,172.59
N$91  (via drill 0.6)
  other vias: 37.72,173.86
N$92  (via drill 0.6)
  other vias: 37.72,175.13
N$93  (via drill 0.6)
  other vias: 36.45,176.4
N$94  (via drill 0.6)
  other vias: 37.72,176.4
N$95  (via drill 0.6)
  other vias: 37.72,177.67
N$96  (via drill 0.6)
  other vias: 36.45,177.67
N$97  (via drill 0.6)
  other vias: 35.18,177.67
N$98  (via drill 0.6)
  other vias: 35.18,176.4
N$99  (via drill 0.6)
  other vias: 35.18,175.13
N$100
  Top 0.406: 130.83,88.5 C17.1
  Top 0.813: OKI-78SR-5/1.5-W36H.3 127.51,84.71 L3.1 130.56,84.97 C17.1
N$101  (via drill 0.6)
  other vias: 36.45,175.13
N$102  (via drill 0.6)
  other vias: 36.45,173.86
N$103  (via drill 0.6)
  other vias: 35.18,173.86
N$104  (via drill 0.6)
  other vias: 35.18,172.59
N$105  (via drill 0.6)
  other vias: 35.18,171.32
N$106  (via drill 0.6)
  other vias: 36.45,171.32
N$107  (via drill 0.6)
  other vias: 37.72,171.32
N$108  (via drill 0.6)
  other vias: 36.45,162.43
N$109  (via drill 0.6)
  other vias: 41.53,177.67
N$110  (via drill 0.6)
  other vias: 41.53,176.4
N$111  (via drill 0.6)
  other vias: 41.53,175.13
N$112  (via drill 0.6)
  other vias: 41.53,173.86
N$113  (via drill 0.6)
  other vias: 41.53,172.59
N$114
  Top 0.305: R15.1 114.05,170.05 114.05,171.34 Q12.1
N$115  (via drill 0.6)
  other vias: 41.53,171.32
N$116  (via drill 0.6)
  other vias: 37.72,162.43
N$117  (via drill 0.6)
  other vias: 38.99,162.43
N$118  (via drill 0.6)
  other vias: 41.53,162.43
N$119  (via drill 0.6)
  other vias: 40.26,161.16
N$120  (via drill 0.6)
  other vias: 40.26,159.89
N$121  (via drill 0.6)
  other vias: 40.26,157.35
N$122  (via drill 0.6)
  other vias: 40.26,158.62
N$123  (via drill 0.6)
  other vias: 40.26,156.08
N$124  (via drill 0.6)
  other vias: 38.99,161.16
N$125  (via drill 0.6)
  other vias: 38.99,159.89
N$126  (via drill 0.6)
  other vias: 38.99,158.62
N$127  (via drill 0.6)
  other vias: 38.99,157.35
N$128  (via drill 0.6)
  other vias: 38.99,156.08
N$129  (via drill 0.6)
  other vias: 38.99,154.81
N$130  (via drill 0.6)
  other vias: 36.45,156.08
N$131  (via drill 0.6)
  other vias: 37.72,156.08
N$132  (via drill 0.6)
  other vias: 37.72,157.35
N$133  (via drill 0.6)
  other vias: 37.72,158.62
N$134  (via drill 0.6)
  other vias: 36.45,159.89
N$135  (via drill 0.6)
  other vias: 37.72,159.89
N$136  (via drill 0.6)
  other vias: 37.72,161.16
N$137  (via drill 0.6)
  other vias: 36.45,161.16
N$138  (via drill 0.6)
  other vias: 35.18,161.16
N$139  (via drill 0.6)
  other vias: 35.18,159.89
N$140  (via drill 0.6)
  other vias: 35.18,158.62
N$141  (via drill 0.6)
  other vias: 36.45,158.62
N$142  (via drill 0.6)
  other vias: 36.45,157.35
N$143  (via drill 0.6)
  other vias: 35.18,157.35
N$144  (via drill 0.6)
  other vias: 35.18,156.08
N$145  (via drill 0.6)
  other vias: 35.18,154.81
N$146  (via drill 0.6)
  other vias: 36.45,154.81
N$147  (via drill 0.6)
  other vias: 37.72,154.81
N$148  (via drill 0.6)
  other vias: 41.53,161.16
N$149  (via drill 0.6)
  other vias: 41.53,159.89
N$150  (via drill 0.6)
  other vias: 41.53,158.62
N$151  (via drill 0.6)
  other vias: 41.53,157.35
N$152  (via drill 0.6)
  other vias: 41.53,156.08
N$153  (via drill 0.6)
  other vias: 41.53,154.81
N$154  (via drill 0.6)  (1 unrouted)
  other vias: 35.18,145.92 35.18,144.65
N$155  (via drill 0.6)
  other vias: 36.45,145.92
N$156  (via drill 0.6)
  other vias: 37.72,145.92
N$157  (via drill 0.6)
  other vias: 38.99,145.92
N$158  (via drill 0.6)
  other vias: 41.53,145.92
N$159  (via drill 0.6)
  other vias: 40.26,144.65
N$160  (via drill 0.6)
  other vias: 40.26,143.38
N$161  (via drill 0.6)
  other vias: 40.26,140.84
N$162  (via drill 0.6)
  other vias: 40.26,142.11
N$163  (via drill 0.6)
  other vias: 40.26,139.57
N$164  (via drill 0.6)
  other vias: 38.99,144.65
N$165  (via drill 0.6)
  other vias: 38.99,143.38
N$166  (via drill 0.6)
  other vias: 38.99,142.11
N$167  (via drill 0.6)
  other vias: 38.99,140.84
N$168  (via drill 0.6)
  other vias: 38.99,139.57
N$169  (via drill 0.6)
  other vias: 38.99,138.3
N$170  (via drill 0.6)
  other vias: 36.45,139.57
N$171  (via drill 0.6)
  other vias: 37.72,139.57
N$172  (via drill 0.6)
  other vias: 37.72,140.84
N$173  (via drill 0.6)
  other vias: 37.72,142.11
N$174  (via drill 0.6)
  other vias: 36.45,143.38
N$175  (via drill 0.6)
  other vias: 37.72,143.38
N$176  (via drill 0.6)
  other vias: 37.72,144.65
N$177  (via drill 0.6)
  other vias: 36.45,144.65
N$178  (via drill 0.6)
  other vias: 35.18,144.65
N$179  (via drill 0.6)
  other vias: 35.18,143.38
N$180  (via drill 0.6)
  other vias: 35.18,142.11
N$181  (via drill 0.6)
  other vias: 36.45,142.11
N$182  (via drill 0.6)
  other vias: 36.45,140.84
N$183  (via drill 0.6)
  other vias: 35.18,140.84
N$184  (via drill 0.6)
  other vias: 35.18,139.57
N$185  (via drill 0.6)
  other vias: 35.18,138.3
N$186  (via drill 0.6)
  other vias: 36.45,138.3
N$187  (via drill 0.6)
  other vias: 37.72,138.3
N$188  (via drill 0.6)
  other vias: 41.53,144.65
N$189  (via drill 0.6)
  other vias: 41.53,143.38
N$190  (via drill 0.6)
  other vias: 41.53,142.11
N$191  (via drill 0.6)
  other vias: 41.53,140.84
N$192  (via drill 0.6)
  other vias: 41.53,139.57
N$193  (via drill 0.6)
  other vias: 41.53,138.3
N$194  (via drill 0.6)  (1 unrouted)
  other vias: 35.18,129.41 35.18,128.14
N$195  (via drill 0.6)
  other vias: 36.45,129.41
N$196  (via drill 0.6)
  other vias: 37.72,129.41
N$197  (via drill 0.6)
  other vias: 38.99,129.41
N$198  (via drill 0.6)
  other vias: 41.53,129.41
N$199  (via drill 0.6)
  other vias: 40.26,128.14
N$200  (via drill 0.6)
  other vias: 40.26,126.87
N$201  (via drill 0.6)
  other vias: 40.26,124.33
N$202  (via drill 0.6)
  other vias: 40.26,125.6
N$203  (via drill 0.6)
  other vias: 40.26,123.06
N$204  (via drill 0.6)
  other vias: 38.99,128.14
N$205  (via drill 0.6)
  other vias: 38.99,126.87
N$206  (via drill 0.6)
  other vias: 38.99,125.6
N$207  (via drill 0.6)
  other vias: 38.99,124.33
N$208  (via drill 0.6)
  other vias: 38.99,123.06
N$209  (via drill 0.6)
  other vias: 38.99,121.79
N$210  (via drill 0.6)
  other vias: 36.45,123.06
N$211  (via drill 0.6)
  other vias: 37.72,123.06
N$212  (via drill 0.6)
  other vias: 37.72,124.33
N$213  (via drill 0.6)
  other vias: 37.72,125.6
N$214  (via drill 0.6)
  other vias: 36.45,126.87
N$215  (via drill 0.6)
  other vias: 37.72,126.87
N$216  (via drill 0.6)
  other vias: 37.72,128.14
N$217  (via drill 0.6)
  other vias: 36.45,128.14
N$218  (via drill 0.6)
  other vias: 35.18,128.14
N$219  (via drill 0.6)
  other vias: 35.18,126.87
N$220  (via drill 0.6)
  other vias: 35.18,125.6
N$221  (via drill 0.6)
  other vias: 36.45,125.6
N$222  (via drill 0.6)
  other vias: 36.45,124.33
N$223  (via drill 0.6)
  other vias: 35.18,124.33
N$224  (via drill 0.6)
  other vias: 35.18,123.06
N$225  (via drill 0.6)
  other vias: 35.18,121.79
N$226  (via drill 0.6)
  other vias: 36.45,121.79
N$227  (via drill 0.6)
  other vias: 37.72,121.79
N$228  (via drill 0.6)
  other vias: 41.53,128.14
N$229  (via drill 0.6)
  other vias: 41.53,126.87
N$230  (via drill 0.6)
  other vias: 41.53,125.6
N$231  (via drill 0.6)
  other vias: 41.53,124.33
N$232  (via drill 0.6)
  other vias: 41.53,123.06
N$233  (via drill 0.6)
  other vias: 41.53,121.79
N$234  (via drill 0.6)  (1 unrouted)
  other vias: 35.18,112.9 35.18,111.63
N$235  (via drill 0.6)
  other vias: 36.45,112.9
N$236  (via drill 0.6)
  other vias: 37.72,112.9
N$237  (via drill 0.6)
  other vias: 38.99,112.9
N$238  (via drill 0.6)
  other vias: 41.53,112.9
N$239  (via drill 0.6)
  other vias: 40.26,111.63
N$240  (via drill 0.6)
  other vias: 40.26,110.36
N$241  (via drill 0.6)
  other vias: 40.26,107.82
N$242  (via drill 0.6)
  other vias: 40.26,109.09
N$243  (via drill 0.6)
  other vias: 40.26,106.55
N$244  (via drill 0.6)
  other vias: 38.99,111.63
N$245  (via drill 0.6)
  other vias: 38.99,110.36
N$246  (via drill 0.6)
  other vias: 38.99,109.09
N$247  (via drill 0.6)
  other vias: 38.99,107.82
N$248  (via drill 0.6)
  other vias: 38.99,106.55
N$249  (via drill 0.6)
  other vias: 38.99,105.28
N$250  (via drill 0.6)
  other vias: 36.45,106.55
N$251  (via drill 0.6)
  other vias: 37.72,106.55
N$252  (via drill 0.6)
  other vias: 37.72,107.82
N$253  (via drill 0.6)
  other vias: 37.72,109.09
N$254  (via drill 0.6)
  other vias: 36.45,110.36
N$255  (via drill 0.6)
  other vias: 37.72,110.36
N$256  (via drill 0.6)
  other vias: 37.72,111.63
N$257  (via drill 0.6)
  other vias: 36.45,111.63
N$258  (via drill 0.6)
  other vias: 35.18,111.63
N$259  (via drill 0.6)
  other vias: 35.18,110.36
N$260  (via drill 0.6)
  other vias: 35.18,109.09
N$261  (via drill 0.6)
  other vias: 36.45,109.09
N$262  (via drill 0.6)
  other vias: 36.45,107.82
N$263  (via drill 0.6)
  other vias: 35.18,107.82
N$264  (via drill 0.6)
  other vias: 35.18,106.55
N$265  (via drill 0.6)
  other vias: 35.18,105.28
N$266  (via drill 0.6)
  other vias: 36.45,105.28
N$267  (via drill 0.6)
  other vias: 37.72,105.28
N$268  (via drill 0.6)
  other vias: 41.53,111.63
N$269  (via drill 0.6)
  other vias: 41.53,110.36
N$270  (via drill 0.6)
  other vias: 41.53,109.09
N$271  (via drill 0.6)
  other vias: 41.53,107.82
N$272  (via drill 0.6)
  other vias: 41.53,106.55
N$273  (via drill 0.6)
  other vias: 41.53,105.28
N$274  (via drill 0.6)  (1 unrouted)
  other vias: 35.18,96.39 35.18,95.12
N$275  (via drill 0.6)
  other vias: 36.45,96.39
N$276  (via drill 0.6)
  other vias: 37.72,96.39
N$277  (via drill 0.6)
  other vias: 38.99,96.39
N$278  (via drill 0.6)
  other vias: 41.53,96.39
N$279  (via drill 0.6)
  other vias: 40.26,95.12
N$280  (via drill 0.6)
  other vias: 40.26,93.85
N$281  (via drill 0.6)
  other vias: 40.26,91.31
N$282  (via drill 0.6)
  other vias: 40.26,92.58
N$283  (via drill 0.6)
  other vias: 40.26,90.04
N$284  (via drill 0.6)
  other vias: 38.99,95.12
N$285  (via drill 0.6)
  other vias: 38.99,93.85
N$286  (via drill 0.6)
  other vias: 38.99,92.58
N$287  (via drill 0.6)
  other vias: 38.99,91.31
N$288  (via drill 0.6)
  other vias: 38.99,90.04
N$289  (via drill 0.6)
  other vias: 38.99,88.77
N$290  (via drill 0.6)
  other vias: 36.45,90.04
N$291  (via drill 0.6)
  other vias: 37.72,90.04
N$292  (via drill 0.6)
  other vias: 37.72,91.31
N$293  (via drill 0.6)
  other vias: 37.72,92.58
N$294  (via drill 0.6)
  other vias: 36.45,93.85
N$295  (via drill 0.6)
  other vias: 37.72,93.85
N$296  (via drill 0.6)
  other vias: 37.72,95.12
N$297  (via drill 0.6)
  other vias: 36.45,95.12
N$298  (via drill 0.6)
  other vias: 35.18,95.12
N$299  (via drill 0.6)
  other vias: 35.18,93.85
N$300  (via drill 0.6)
  other vias: 35.18,92.58
N$301  (via drill 0.6)
  other vias: 36.45,92.58
N$302  (via drill 0.6)
  other vias: 36.45,91.31
N$303  (via drill 0.6)
  other vias: 35.18,91.31
N$304  (via drill 0.6)
  other vias: 35.18,90.04
N$305  (via drill 0.6)
  other vias: 35.18,88.77
N$306  (via drill 0.6)
  other vias: 36.45,88.77
N$307  (via drill 0.6)
  other vias: 37.72,88.77
N$308  (via drill 0.6)
  other vias: 41.53,95.12
N$309  (via drill 0.6)
  other vias: 41.53,93.85
N$310  (via drill 0.6)
  other vias: 41.53,92.58
N$311  (via drill 0.6)
  other vias: 41.53,91.31
N$312  (via drill 0.6)
  other vias: 41.53,90.04
N$313  (via drill 0.6)
  other vias: 41.53,88.77
N$314  (via drill 0.6)  (1 unrouted)
  other vias: 35.18,79.88 35.18,78.61
N$315  (via drill 0.6)
  other vias: 36.45,79.88
N$316  (via drill 0.6)
  other vias: 37.72,79.88
N$317  (via drill 0.6)
  other vias: 38.99,79.88
N$318  (via drill 0.6)
  other vias: 41.53,79.88
N$319  (via drill 0.6)
  other vias: 40.26,78.61
N$320  (via drill 0.6)
  other vias: 40.26,77.34
N$321  (via drill 0.6)
  other vias: 40.26,74.8
N$322  (via drill 0.6)
  other vias: 40.26,76.07
N$323  (via drill 0.6)
  other vias: 40.26,73.53
N$324  (via drill 0.6)
  other vias: 38.99,78.61
N$325  (via drill 0.6)
  other vias: 38.99,77.34
N$326  (via drill 0.6)
  other vias: 38.99,76.07
N$327  (via drill 0.6)
  other vias: 38.99,74.8
N$328  (via drill 0.6)
  other vias: 38.99,73.53
N$329  (via drill 0.6)
  other vias: 38.99,72.26
N$330  (via drill 0.6)
  other vias: 36.45,73.53
N$331  (via drill 0.6)
  other vias: 37.72,73.53
N$332  (via drill 0.6)
  other vias: 37.72,74.8
N$333  (via drill 0.6)
  other vias: 37.72,76.07
N$334  (via drill 0.6)
  other vias: 36.45,77.34
N$335  (via drill 0.6)
  other vias: 37.72,77.34
N$336  (via drill 0.6)
  other vias: 37.72,78.61
N$337  (via drill 0.6)
  other vias: 36.45,78.61
N$338  (via drill 0.6)
  other vias: 35.18,78.61
N$339  (via drill 0.6)
  other vias: 35.18,77.34
N$340  (via drill 0.6)
  other vias: 35.18,76.07
N$341  (via drill 0.6)
  other vias: 36.45,76.07
N$342  (via drill 0.6)
  other vias: 36.45,74.8
N$343  (via drill 0.6)
  other vias: 35.18,74.8
N$344  (via drill 0.6)
  other vias: 35.18,73.53
N$345  (via drill 0.6)
  other vias: 35.18,72.26
N$346  (via drill 0.6)
  other vias: 36.45,72.26
N$347  (via drill 0.6)
  other vias: 37.72,72.26
N$348  (via drill 0.6)
  other vias: 41.53,78.61
N$349  (via drill 0.6)
  other vias: 41.53,77.34
N$350  (via drill 0.6)
  other vias: 41.53,76.07
N$351  (via drill 0.6)
  other vias: 41.53,74.8
N$352  (via drill 0.6)
  other vias: 41.53,73.53
N$353  (via drill 0.6)
  other vias: 41.53,72.26
N$354
  Top 0.406: IRLS3034-7P.1 52.7,53.21 52.96,52.96 52.96,35.43 | IRLS3034-7P.2.1 52.96,35.43 | 52.96,35.43 52.96,22.23 53.97,21.21 54.04,19.94 U$23.5
N$355
  pour Top (no thermals): 77.09,57.02 115.19,57.02 115.19,21.46 77.09,21.46
  pour Bottom (no thermals): 77.09,57.02 115.19,57.02 115.19,21.46 77.09,21.46
N$356  (via drill 0.5, 0.6)
  Top 0.406: C46.1 48.39,19.18 48.95,19.75 U$23.8 50.29,17.78 50.93,17.15 52.96,17.15 | U$23.6 52.83,17.27 52.96,17.15 | v58.04,10.54 59.56,10.8 | 52.96,17.15 62.86,17.15 D3.TAB
  Bottom 0.406: S1.1 55.5,8 v58.04,10.54
  other vias: 65.15,35.43 63.88,29.08 65.15,27.81 60.07,30.35 62.61,27.81 61.34,31.62 60.07,32.89 58.8,34.16 57.53,32.89 62.61,35.43 61.34,34.16 58.8,31.62 57.53,27.81 60.07,27.81 61.34,29.08 58.8,29.08 65.15,30.35 57.53,30.35 63.88,34.16 57.53,35.43 62.61,32.89 60.07,35.43 63.88,31.62 62.61,30.35 65.15,32.89 63.63,46.86 64.9,48.13 62.36,50.67 64.9,53.21 63.63,51.94 61.09,49.4 62.36,45.59 61.09,46.86 58.55,46.86 64.9,45.59 64.9,50.67 63.63,49.4 61.09,51.94 58.55,51.94 57.28,50.67 62.36,53.21 59.82,53.21 59.82,50.67 57.28,53.21 62.36,48.13 59.82,48.13 57.28,48.13 58.55,49.4 59.82,45.59 57.28,45.59
  pour Bottom (no thermals): 55.5,57.02 74.55,57.02 74.55,21.46 55.5,21.46
  pour Top (no thermals): 55.5,57.02 55.5,21.46 55.5,11.3 56.77,10.03 68.2,10.03 69.47,11.3 69.47,20.19 70.74,21.46 74.55,21.46 74.55,57.02
N$357
  Top 0.406: 50.42,3.68 59.05,3.68 | S1.3 50.42,3.68 | 50.42,3.68 45.95,3.68 R21.1
  pour Top (no thermals): 59.31,2.92 84.2,2.92 84.2,10.29 71.25,10.29 68.45,7.49 59.31,7.49 58.04,6.22 58.04,4.19
N$358
  Top 0.406: S1.2 52.96,6.22 52.45,6.73 45.19,6.73 R25.2 45.11,6.6 F1.1
PRIMARY-VMEAS
  Top 0.406: R3.1 R4.2 92.33,100.56 92.33,100.08 U$1.19
RXD
  Top 0.305: U$3.RO 120.02,108.46 120.65,109.09 120.65,112.14 120.27,112.78 U$1.4
V_BATT
  Top 1.27: Q1.1 51.63,190.43 54.23,187.83
  pour Top (rank 2, no thermals): 47.88,178.94 47.88,172.59 52.96,172.59 52.96,162.43 47.88,162.43 47.88,156.08 52.96,156.08 52.96,145.92 47.88,145.92 47.88,139.57 52.96,139.57 52.96,129.41 47.88,129.41 47.88,123.06 52.96,123.06 52.96,112.9 47.88,112.9 47.88,106.55 52.96,106.55 52.96,96.39 48.2,96.39 48.2,90.04 52.96,90.04 52.96,79.88 47.88,79.88 47.88,73.53 52.96,73.53 58.13,66.42 88.52,66.39 88.52,170.05 89.15,171.32 89.15,189.1 52.96,189.1 52.96,178.94
V_CHECK
  Top 0.406: R27.2 48.39,9.42 R25.1 45.85,10.54 45.08,11.3 43.05,11.3 42.29,12.07 42.29,12.57 41.78,13.08 39.5,13.08 JP1.4
V_CHG
  Top 0.406: R21.2 R23.1 40,3.94 39.75,4.19 39.75,9.84 JP1.1 39.81,10.03
V_OUT
  Top 0.406: R14.2 R17.1 42.4,16.09 JP1.7

## Text on the board
tStop: Jake Armenta / Missouri MRDT / Powerboard 2015